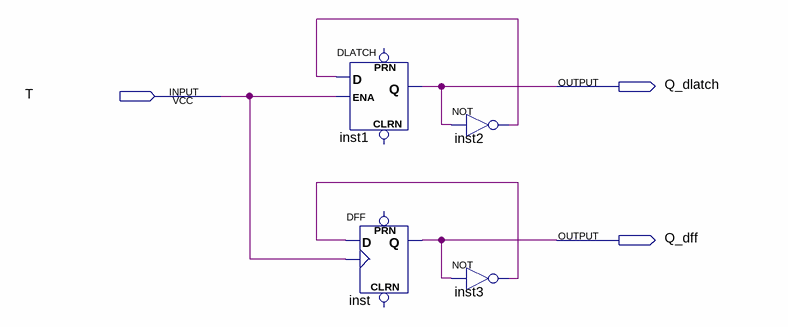
[diagram p0: schematic sheet]
// Quartus schematic t_trig.bdf as structural Verilog: 4 symbols, 3 pins
module t_trig (
  input  T,
  output Q_dlatch,
  output Q_dff
);

  wire inst2_out, inst3_out;

  DLATCH inst1 (.D(inst2_out), .ENA(T), .Q(Q_dlatch));  // open: CLRN, PRN
  DFF inst (.CLK(T), .D(inst3_out), .Q(Q_dff));  // open: CLRN, PRN
  not inst2 (inst2_out, Q_dlatch);
  not inst3 (inst3_out, Q_dff);
endmodule
